# EAGLE design MicrocontrollerModule (EAGLE 8.3.2)
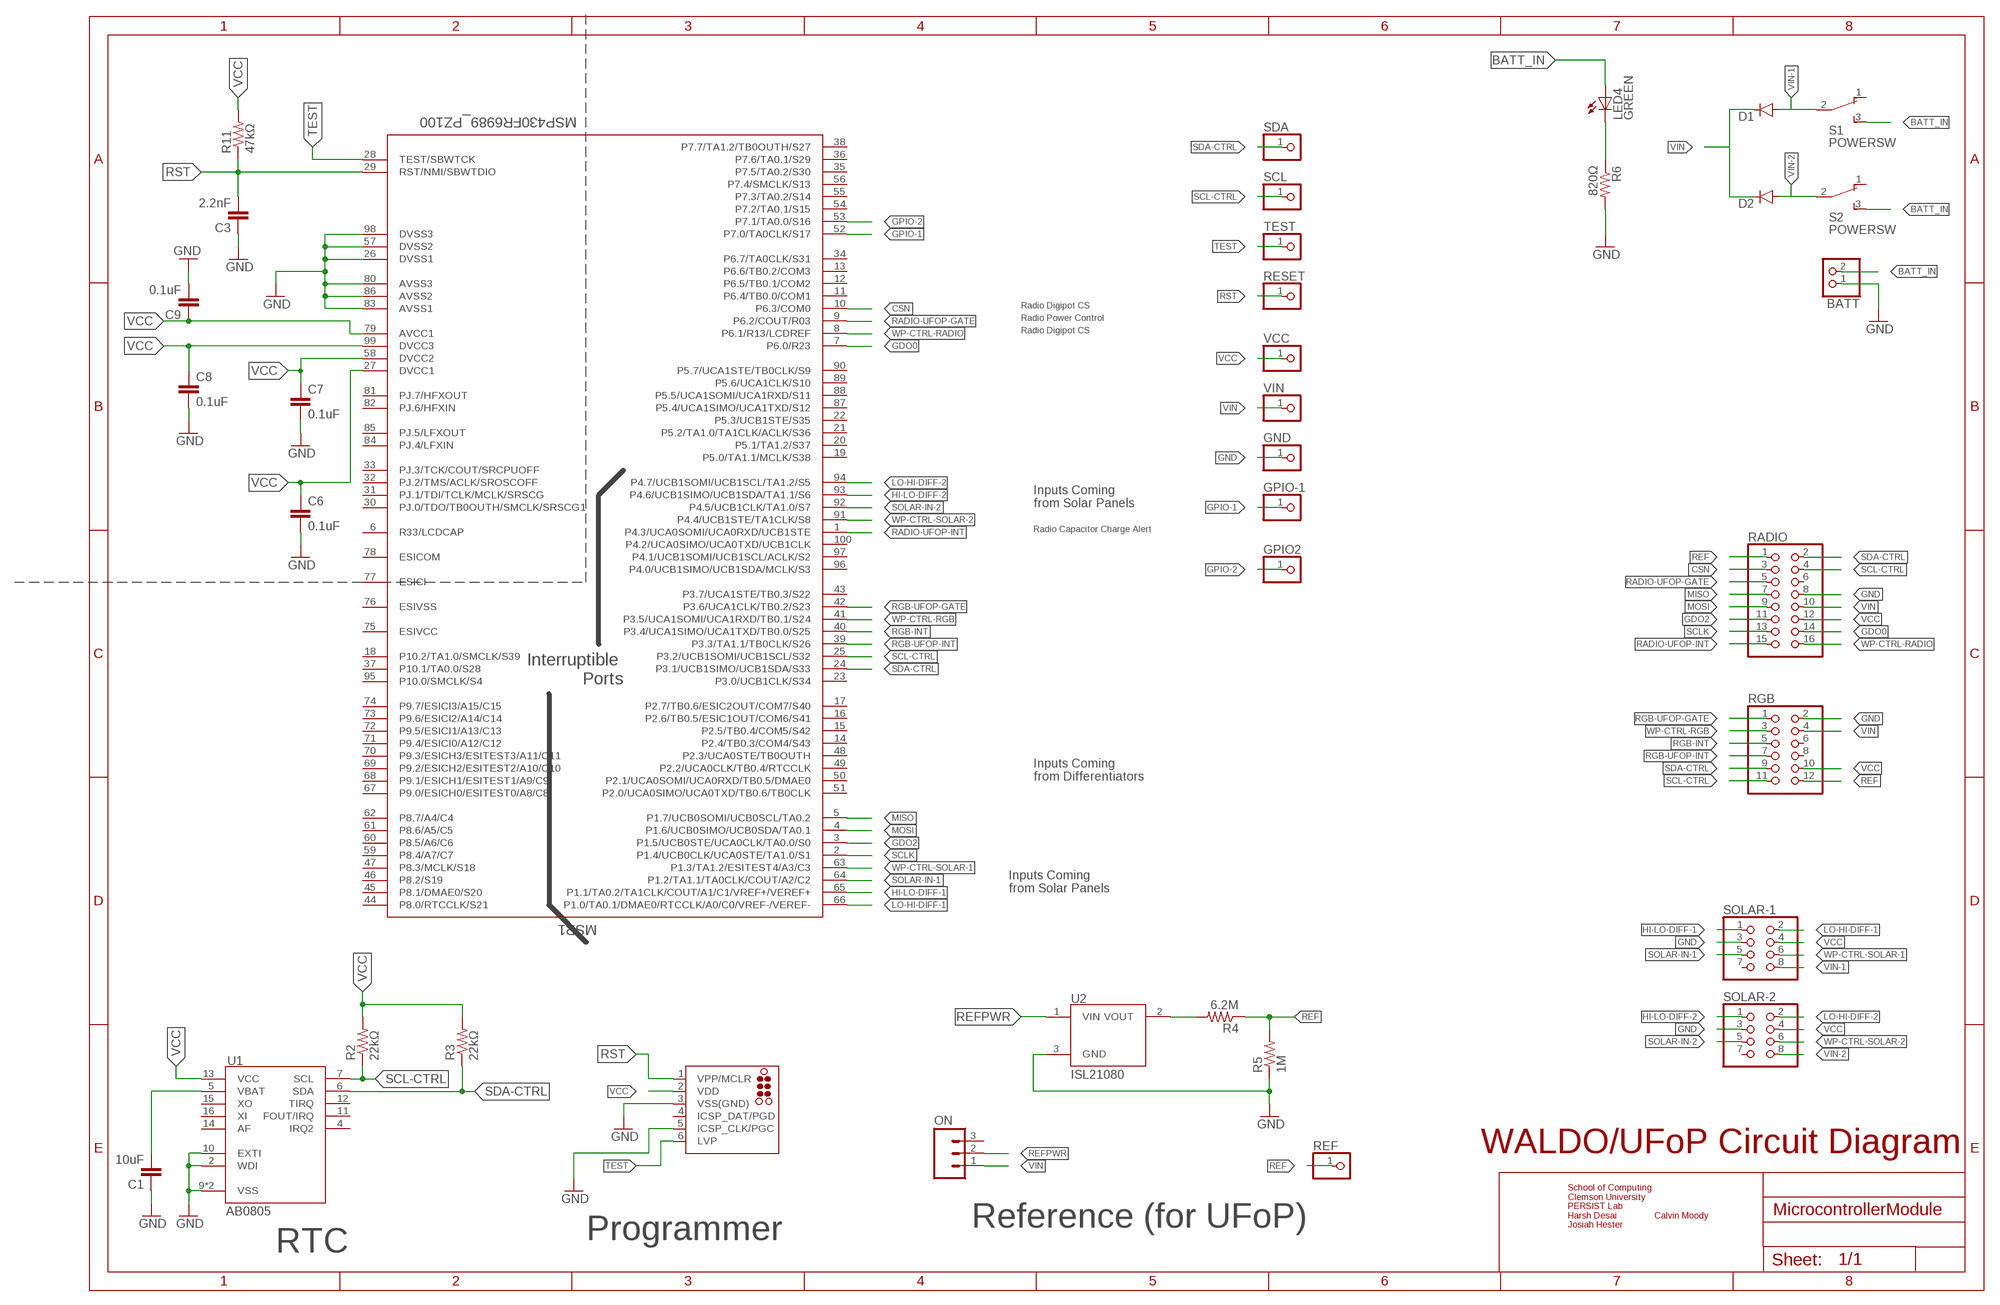
[diagram p0: schematic, sheet 1]

## Parts
BATT  PINHD-1X2  [1X02]
C1  10uF  CAP0805  [0805]
C3  2.2nF  CAP0805  [0805]
C6  0.1uF  CAP0805  [0805]
C7  0.1uF  CAP0805  [0805]
C8  0.1uF  CAP0805  [0805]
C9  0.1uF  CAP0805  [0805]
D1  DIODESOD523  [SOD523]
D2  DIODESOD523  [SOD523]
GND  PINHD-1X1  [1X01]
GPIO2  PINHD-1X1  [1X01]
GPIO-1  PINHD-1X1  [1X01]
J1  TC2030-MCP-NL  [TC2030-MCP-NL]
LED4  GREEN  LEDCHIP-LED0805  [CHIP-LED0805]
MSP1  MSP430FR6989_PZ100  [PZ100]
ON  M03  [1X03-1.27MM]
R2  22kΩ  RESISTOR0805-RES  [0805]
R3  22kΩ  RESISTOR0805-RES  [0805]
R4  6.2M  RESISTOR0805-RES  [0805]
R5  1M  RESISTOR0805-RES  [0805]
R6  820Ω  RESISTOR0805-RES  [0805]
R11  47kΩ  RESISTOR0805-RES  [0805]
RADIO  PINHD-2X8/90  [2X08/90]
REF  PINHD-1X1  [1X01]
RESET  PINHD-1X1  [1X01]
RGB  PINHD-2X6/90  [2X06/90]
S1  POWERSW  [TL3XYO]
S2  POWERSW  [TL3XYO]
SCL  PINHD-1X1  [1X01]
SDA  PINHD-1X1  [1X01]
SOLAR-1  PINHD-2X4/90  [2X04/90]
SOLAR-2  PINHD-2X4/90  [2X04/90]
TEST  PINHD-1X1  [1X01]
U1  AB0805  [QFN16]
U2  ISL21080  [SOT-23]
VCC  PINHD-1X1  [1X01]
VIN  PINHD-1X1  [1X01]

## Nets
BATT_IN: BATT.2 LED4.A S1.3(S) S2.3(S)
CSN: MSP1.10(P6.3/COM0) RADIO.3
GDO0: MSP1.7(P6.0/R23) RADIO.14
GDO2: MSP1.3(P1.5/UCB0STE/UCA0CLK/TA0.0/S0) RADIO.11
GND: BATT.1 C1.1 C3.1 C6.2 C7.2 C8.2 C9.2 GND.1 J1.3(VSS(GND)) J1.5(ICSP_CLK/PGC) MSP1.26(DVSS1) MSP1.57(DVSS2) MSP1.80(AVSS3) MSP1.83(AVSS1) MSP1.86(AVSS2) MSP1.98(DVSS3) R5.1 R6.2 RADIO.8 RGB.2 SOLAR-1.3 SOLAR-2.3 U1.2(WDI) U1.9(VSS) U1.10(EXTI) U1.TH(VSS) U2.3(GND)
GPIO-1: GPIO-1.1 MSP1.52(P7.0/TA0CLK/S17)
GPIO-2: GPIO2.1 MSP1.53(P7.1/TA0.0/S16)
HI-LO-DIFF-1: MSP1.65(P1.1/TA0.2/TA1CLK/COUT/A1/C1/VREF+/VEREF+) SOLAR-1.1
HI-LO-DIFF-2: MSP1.93(P4.6/UCB1SIMO/UCB1SDA/TA1.1/S6) SOLAR-2.1
LO-HI-DIFF-1: MSP1.66(P1.0/TA0.1/DMAE0/RTCCLK/A0/C0/VREF-/VEREF-) SOLAR-1.2
LO-HI-DIFF-2: MSP1.94(P4.7/UCB1SOMI/UCB1SCL/TA1.2/S5) SOLAR-2.2
MISO: MSP1.5(P1.7/UCB0SOMI/UCB0SCL/TA0.2) RADIO.7
MOSI: MSP1.4(P1.6/UCB0SIMO/UCB0SDA/TA0.1) RADIO.9
N$4: C1.2 U1.5(VBAT)
N$11: LED4.C R6.1
N$12: R4.2 U2.2(VOUT)
RADIO-UFOP-GATE: MSP1.9(P6.2/COUT/R03) RADIO.5
RADIO-UFOP-INT: MSP1.1(P4.3/UCA0SOMI/UCA0RXD/UCB1STE) RADIO.15
REF: R4.1 R5.2 RADIO.1 REF.1 RGB.12
REFPWR: ON.2 U2.1(VIN)
RGB-INT: MSP1.40(P3.4/UCA1SIMO/UCA1TXD/TB0.0/S25) RGB.5
RGB-UFOP-GATE: MSP1.42(P3.6/UCA1CLK/TB0.2/S23) RGB.1
RGB-UFOP-INT: MSP1.39(P3.3/TA1.1/TB0CLK/S26) RGB.7
RST: C3.2 J1.1(VPP/MCLR) MSP1.29(RST/NMI/SBWTDIO) R11.1 RESET.1
SCL-CTRL: MSP1.25(P3.2/UCB1SOMI/UCB1SCL/S32) R2.1 RADIO.4 RGB.11 SCL.1 U1.7(SCL)
SCLK: MSP1.2(P1.4/UCB0CLK/UCA0STE/TA1.0/S1) RADIO.13
SDA-CTRL: MSP1.24(P3.1/UCB1SIMO/UCB1SDA/S33) R3.1 RADIO.2 RGB.9 SDA.1 U1.6(SDA)
SOLAR-IN-1: MSP1.64(P1.2/TA1.1/TA0CLK/COUT/A2/C2) SOLAR-1.5
SOLAR-IN-2: MSP1.92(P4.5/UCB1CLK/TA1.0/S7) SOLAR-2.5
TEST: J1.6(LVP) MSP1.28(TEST/SBWTCK) TEST.1
VCC: C6.1 C7.1 C8.1 C9.1 J1.2(VDD) MSP1.27(DVCC1) MSP1.58(DVCC2) MSP1.79(AVCC1) MSP1.99(DVCC3) R2.2 R3.2 R11.2 RADIO.12 RGB.10 SOLAR-1.4 SOLAR-2.4 U1.13(VCC) VCC.1
VIN: D1.C D2.C ON.1 RADIO.10 RGB.4 VIN.1
VIN-1: D1.A S1.2(P) SOLAR-1.8
VIN-2: D2.A S2.2(P) SOLAR-2.8
WP-CTRL-RADIO: MSP1.8(P6.1/R13/LCDREF) RADIO.16
WP-CTRL-RGB: MSP1.41(P3.5/UCA1SOMI/UCA1RXD/TB0.1/S24) RGB.3
WP-CTRL-SOLAR-1: MSP1.63(P1.3/TA1.2/ESITEST4/A3/C3) SOLAR-1.6
WP-CTRL-SOLAR-2: MSP1.91(P4.4/UCB1STE/TA1CLK/S8) SOLAR-2.6
Unconnected: J1.4(ICSP_DAT/PGD) MSP1.6(R33/LCDCAP) MSP1.11(P6.4/TB0.0/COM1) MSP1.12(P6.5/TB0.1/COM2) MSP1.13(P6.6/TB0.2/COM3) MSP1.14(P2.4/TB0.3/COM4/S43) MSP1.15(P2.5/TB0.4/COM5/S42) MSP1.16(P2.6/TB0.5/ESIC1OUT/COM6/S41) MSP1.17(P2.7/TB0.6/ESIC2OUT/COM7/S40) MSP1.18(P10.2/TA1.0/SMCLK/S39) MSP1.19(P5.0/TA1.1/MCLK/S38) MSP1.20(P5.1/TA1.2/S37) MSP1.21(P5.2/TA1.0/TA1CLK/ACLK/S36) MSP1.22(P5.3/UCB1STE/S35) MSP1.23(P3.0/UCB1CLK/S34) MSP1.30(PJ.0/TDO/TB0OUTH/SMCLK/SRSCG1) MSP1.31(PJ.1/TDI/TCLK/MCLK/SRSCG) MSP1.32(PJ.2/TMS/ACLK/SROSCOFF) MSP1.33(PJ.3/TCK/COUT/SRCPUOFF) MSP1.34(P6.7/TA0CLK/S31) MSP1.35(P7.5/TA0.2/S30) MSP1.36(P7.6/TA0.1/S29) MSP1.37(P10.1/TA0.0/S28) MSP1.38(P7.7/TA1.2/TB0OUTH/S27) MSP1.43(P3.7/UCA1STE/TB0.3/S22) MSP1.44(P8.0/RTCCLK/S21) MSP1.45(P8.1/DMAE0/S20) MSP1.46(P8.2/S19) MSP1.47(P8.3/MCLK/S18) MSP1.48(P2.3/UCA0STE/TB0OUTH) MSP1.49(P2.2/UCA0CLK/TB0.4/RTCCLK) MSP1.50(P2.1/UCA0SOMI/UCA0RXD/TB0.5/DMAE0) MSP1.51(P2.0/UCA0SIMO/UCA0TXD/TB0.6/TB0CLK) MSP1.54(P7.2/TA0.1/S15) MSP1.55(P7.3/TA0.2/S14) MSP1.56(P7.4/SMCLK/S13) MSP1.59(P8.4/A7/C7) MSP1.60(P8.5/A6/C6) MSP1.61(P8.6/A5/C5) MSP1.62(P8.7/A4/C4) MSP1.67(P9.0/ESICH0/ESITEST0/A8/C8) MSP1.68(P9.1/ESICH1/ESITEST1/A9/C9) MSP1.69(P9.2/ESICH2/ESITEST2/A10/C10) MSP1.70(P9.3/ESICH3/ESITEST3/A11/C11) MSP1.71(P9.4/ESICI0/A12/C12) MSP1.72(P9.5/ESICI1/A13/C13) MSP1.73(P9.6/ESICI2/A14/C14) MSP1.74(P9.7/ESICI3/A15/C15) MSP1.75(ESIVCC) MSP1.76(ESIVSS) MSP1.77(ESICI) MSP1.78(ESICOM) MSP1.81(PJ.7/HFXOUT) MSP1.82(PJ.6/HFXIN) MSP1.84(PJ.4/LFXIN) MSP1.85(PJ.5/LFXOUT) MSP1.87(P5.4/UCA1SIMO/UCA1TXD/S12) MSP1.88(P5.5/UCA1SOMI/UCA1RXD/S11) MSP1.89(P5.6/UCA1CLK/S10) MSP1.90(P5.7/UCA1STE/TB0CLK/S9) MSP1.95(P10.0/SMCLK/S4) MSP1.96(P4.0/UCB1SIMO/UCB1SDA/MCLK/S3) MSP1.97(P4.1/UCB1SOMI/UCB1SCL/ACLK/S2) MSP1.100(P4.2/UCA0SIMO/UCA0TXD/UCB1CLK) ON.3 RADIO.6 RGB.6 RGB.8 S1.1(O) S2.1(O) SOLAR-1.7 SOLAR-2.7 U1.4(IRQ2) U1.11(FOUT/IRQ) U1.12(TIRQ) U1.14(AF) U1.15(XO) U1.16(XI)

## Notes on the sheet
- Radio Digipot CS
- Radio Power Control
- Radio Digipot CS
- Inputs Coming 
  from Solar Panels
- Radio Capacitor Charge Alert
- Interruptible 
  Ports
- Inputs Coming 
  from Differentiators
- Inputs Coming 
  from Solar Panels
- WALDO/UFoP Circuit Diagram
- Reference (for UFoP)
- School of Computing
  Clemson University
  PERSIST Lab
  Harsh Desai               Calvin Moody
  Josiah Hester
- Programmer
- RTC

## Library data of the parts
BATT = pinhead:PINHD-1X2: PIN HEADER
C1 C3 C6-C9 = SparkFun-Capacitors:CAP: Capacitor Standard 0603 ceramic capacitor, and 0.1" leaded capacitor.
D1 D2 = SparkFun-DiscreteSemi:DIODE: Diode These are standard reverse protection diodes and small signal diodes. SMA package can handle up to about 1A. SOD-323 can handle about 200mA. What the SOD-323 package when ordering, there are some mfgs out there that are 5-pin packages.
GND GPIO2 GPIO-1 REF RESET SCL SDA TEST VCC VIN = adafruit:PINHD-1X1: Pin header 1x1 for 0.1" spacing With round pins
J1 = tag-connect_msp430:TC2030: TAG-CONNECT ICSP Connector Manufacturer: Tag-Connect <http://www.tag-connect.com> Cable for easy In-Circuit Serial Programming. Designed for Microchip ICD2, suitable for many others. Two variants - one "with legs" (for hands-free fit on PCB) and another "without legs" for quick programming. PAD Description 1 MCLR/Vpp 2 Vdd 3 GND 4 PGD (ISPDAT) 5 PGC (ISPCLK) 6 nc (used for LVP) ©2009 ROFA.cz - modified and updated by Robert Darlington ‹rdarlington@gmail.com›
LED4 = led:LED: LED OSRAM: - CHIPLED LG R971, LG N971, LY N971, LG Q971, LY Q971, LO R971, LY R971 LH N974, LH R974 LS Q976, LO Q976, LY Q976 LO Q996 - Hyper CHIPLED LW Q18S LB Q993, LB Q99A, LB R99A - SideLED LS A670, LO A670, LY A670, LG A670, LP A670 LB A673, LV A673, LT A673, LW A673 LH A674 LY A675 LS A676, LA A676, LO A676, LY A676, LW A676 LS A679, LY A679, LG A679 - Hyper Micro SIDELED® LS Y876, LA Y876, LO Y876, LY Y876 LT Y87S - SmartLED LW L88C, LW L88S LB L89C, LB L89S, LG L890 LS L89K, LO L89K, LY L89K LS L896, LA L896, LO L896, LY L896 - TOPLED LS T670, LO T670, LY T670, LG T670, LP T670 LSG T670, LSP T670, LSY T670, LOP T670, LYG T670 LG T671, LOG T671, LSG T671 LB T673, LV T673, LT T673, LW T673 LH T674 LS T676, LA T676, LO T676, LY T676, LB T676, LH T676, LSB T676, LW T676 LB T67C, LV T67C, LT T67C, LS T67K, LO T67K, LY T67K, LW E67C LS E67B, LA E67B, LO E67B, LY E67B, LB E67C, LV E67C, LT E67C LW T67C LS T679, LY T679, LG T679 LS T770, LO T770, LY T770, LG T770, LP T770 LB T773, LV T773, LT T773, LW T773 LH T774 LS E675, LA E675, LY E675, LS T675 LS T776, LA T776, LO T776, LY T776, LB T776 LHGB T686 LT T68C, LB T68C - Hyper Mini TOPLED® LB M676 - Mini TOPLED Santana® LG M470 LS M47K, LO M47K, LY M47K Source: http://www.osram.convergy.de LUXEON: - LUMILED® LXK2-PW12-R00, LXK2-PW12-S00, LXK2-PW14-U00, LXK2-PW14-V00 LXK2-PM12-R00, LXK2-PM12-S00, LXK2-PM14-U00 LXK2-PE12-Q00, LXK2-PE12-R00, LXK2-PE12-S00, LXK2-PE14-T00, LXK2-PE14-U00 LXK2-PB12-K00, LXK2-PB12-L00, LXK2-PB12-M00, LXK2-PB14-N00, LXK2-PB14-P00, LXK2-PB14-Q00 LXK2-PR12-L00, LXK2-PR12-M00, LXK2-PR14-Q00, LXK2-PR14-R00 LXK2-PD12-Q00, LXK2-PD12-R00, LXK2-PD12-S00 LXK2-PH12-R00, LXK2-PH12-S00 LXK2-PL12-P00, LXK2-PL12-Q00, LXK2-PL12-R00 Source: www.luxeon.com KINGBRIGHT: KA-3528ASYC Source: www.kingbright.com
MSP1 = msp430:MSP430FR6989_PZ100
ON = SparkFun-Connectors:M03: Header 3 Standard 3-pin 0.1" header. Use with straight break away headers (SKU : PRT-00116), right angle break away headers (PRT-00553), swiss pins (PRT-00743), machine pins (PRT-00117), and female headers (PRT-00115). Molex polarized connector foot print use with SKU : PRT-08232 with associated crimp pins and housings.
R2 R3 R6 R11 = SparkFun-Resistors:RESISTOR: Resistor Basic schematic elements and footprints for 0603, 1206, and PTH resistors.
R4 = SparkFun-Resistors:RESISTOR: Resistor Basic schematic elements and footprints for 0603, 1206, and PTH resistors.; DIGIKEY: 541-6.20MHCT-ND
R5 = SparkFun-Resistors:RESISTOR: Resistor Basic schematic elements and footprints for 0603, 1206, and PTH resistors.; DIGIKEY: 311-1.00MHRCT-ND
RADIO = pinhead:PINHD-2X8: PIN HEADER
RGB = pinhead:PINHD-2X6: PIN HEADER
S1 S2 = GreenBoard:POWERSW: TINY SWITCH ON - ON Source: http://www2.produktinfo.conrad.com/datenblaetter/700000-724999/705152-da-01-de-Subminiaturschalter_TL_36YO.pdf
SOLAR-1 SOLAR-2 = pinhead:PINHD-2X4: PIN HEADER
U1 = AB08XX:AB0805: AB08X5 Real-Time Clock Family: I2C Version The ABRACON AB08X5 Real-Time Clock family provides a groundbreaking combination of ultra-low power coupled with a highly sophisticated feature set. With power requirements significantly lower than any other industry RTC (as low as 14 nA), these are the first semiconductors based on innovative SPOTTM (Subthreshold Power Optimized Technology) CMOS platform. The AB08X5 includes on-chip oscillators to provide minimum power consumption, full RTC functions including battery backup and programmable counters and alarms for timer and watchdog functions, and either an I2C or SPI serial interface for communication with a host controller.; MOUSER: 815-AB0805-T3
U2 = isl21080:ISL21080: Intersil: ISL21080, 300nA NanoPower Voltage References The ISL21080 analog voltage references feature low supply voltage operation at ultra-low 310nA typ, 1.5µA max operating current. Additionally, the ISL21080 family features guaranteed initial accuracy as low as ±0.2% and 50ppm/°C temperature coefficient. These references are ideal for general purpose portable applications to extend battery life at lower cost. The ISL21080 is provided in the industry standard 3 Ld SOT-23 pinout. The ISL21080 output voltages can be used as precision voltage sources for voltage monitors, control loops, standby voltages for low power states for DSP, FPGA, Datapath Controllers, microcontrollers and other core voltages: 0.9V, 1.024V, 1.25V, 1.5V, 2.048V, 2.5V, 3.0V, 3.3V, 4.096V and 5.0V. Special Note: Post-assembly x-ray inspection may lead to permanent changes in device output voltage and should be minimized or avoided. For further information, please see “Applications Information” on page 14 and AN1533, “X-Ray Effects on Intersil FGA References”.; DIGIKEY: ISL21080DIH309Z-TKCT-ND

## Board
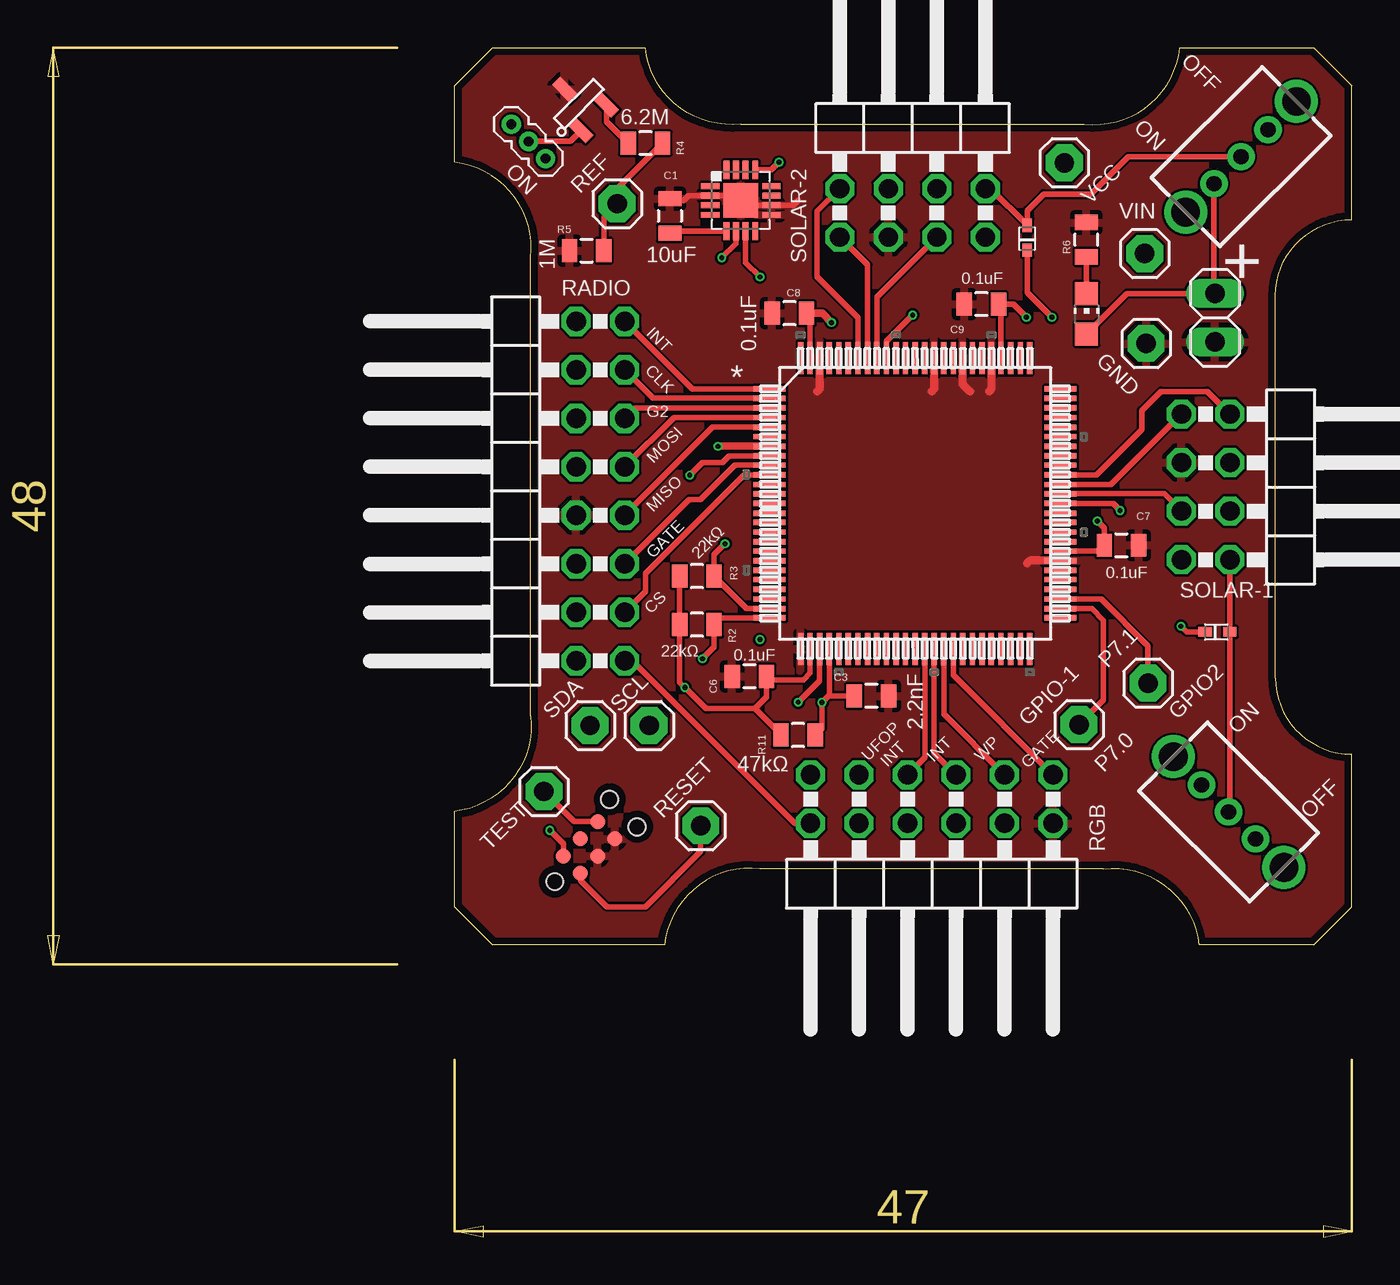
[diagram p1: board, top side]
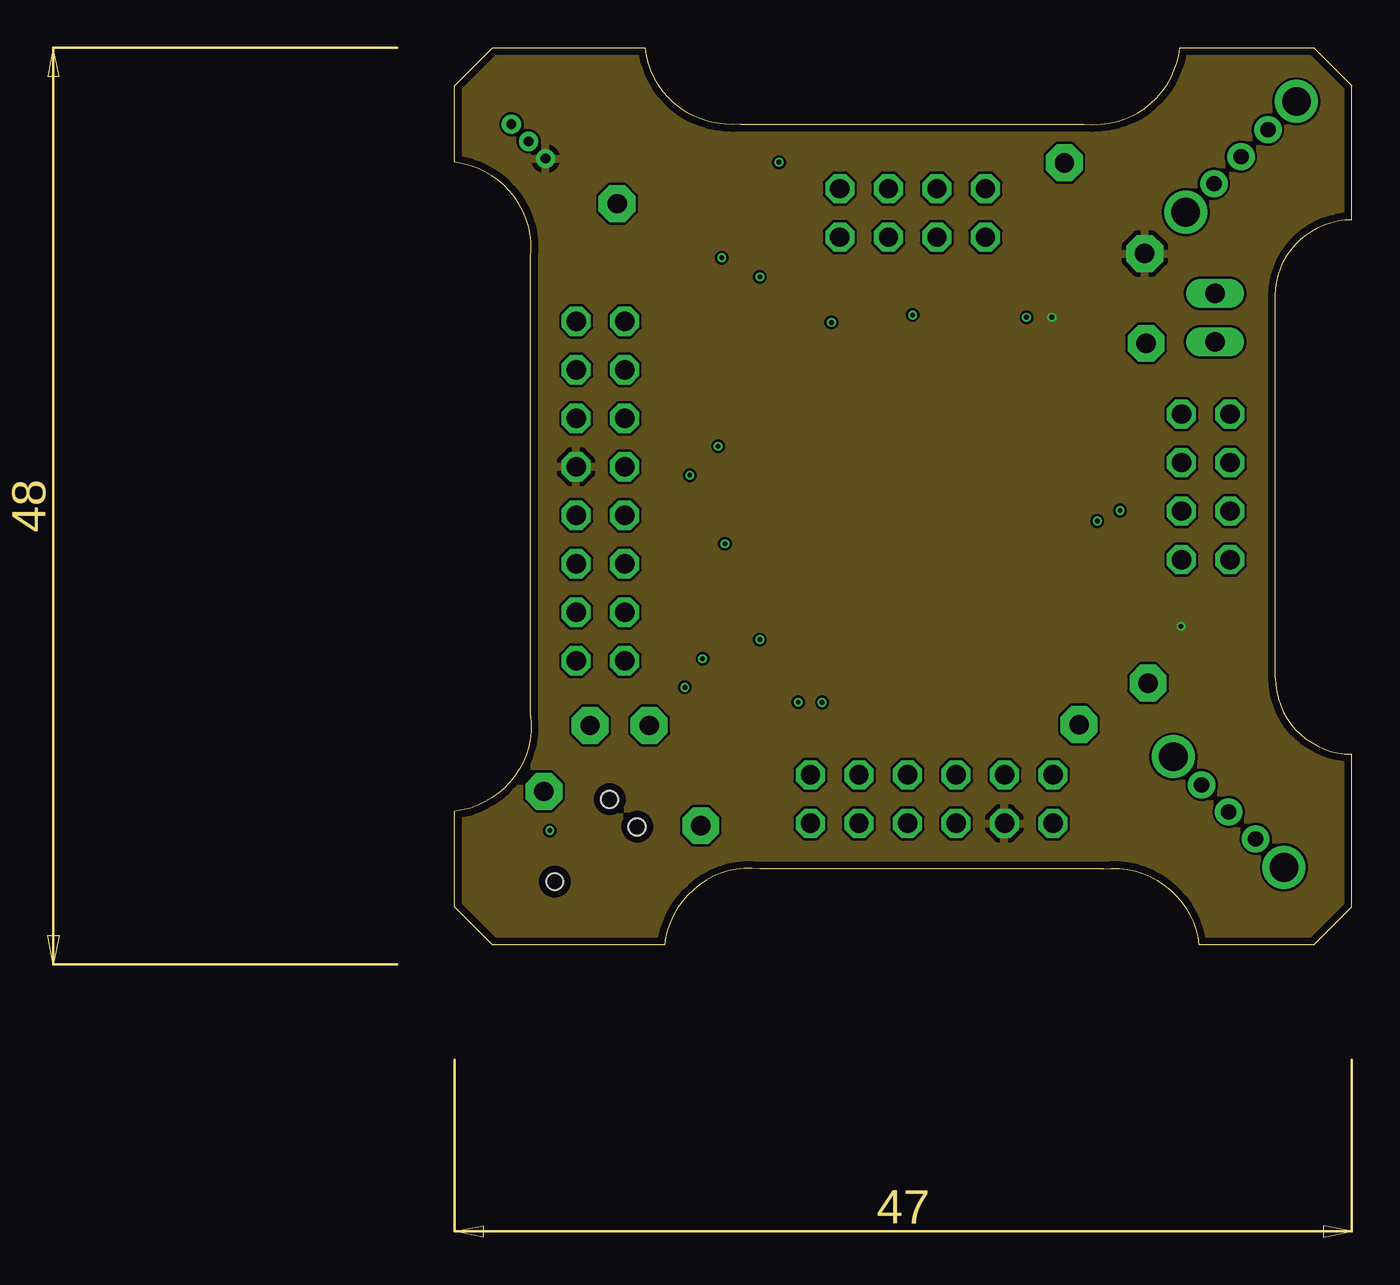
[diagram p2: board, inner layer Vin]
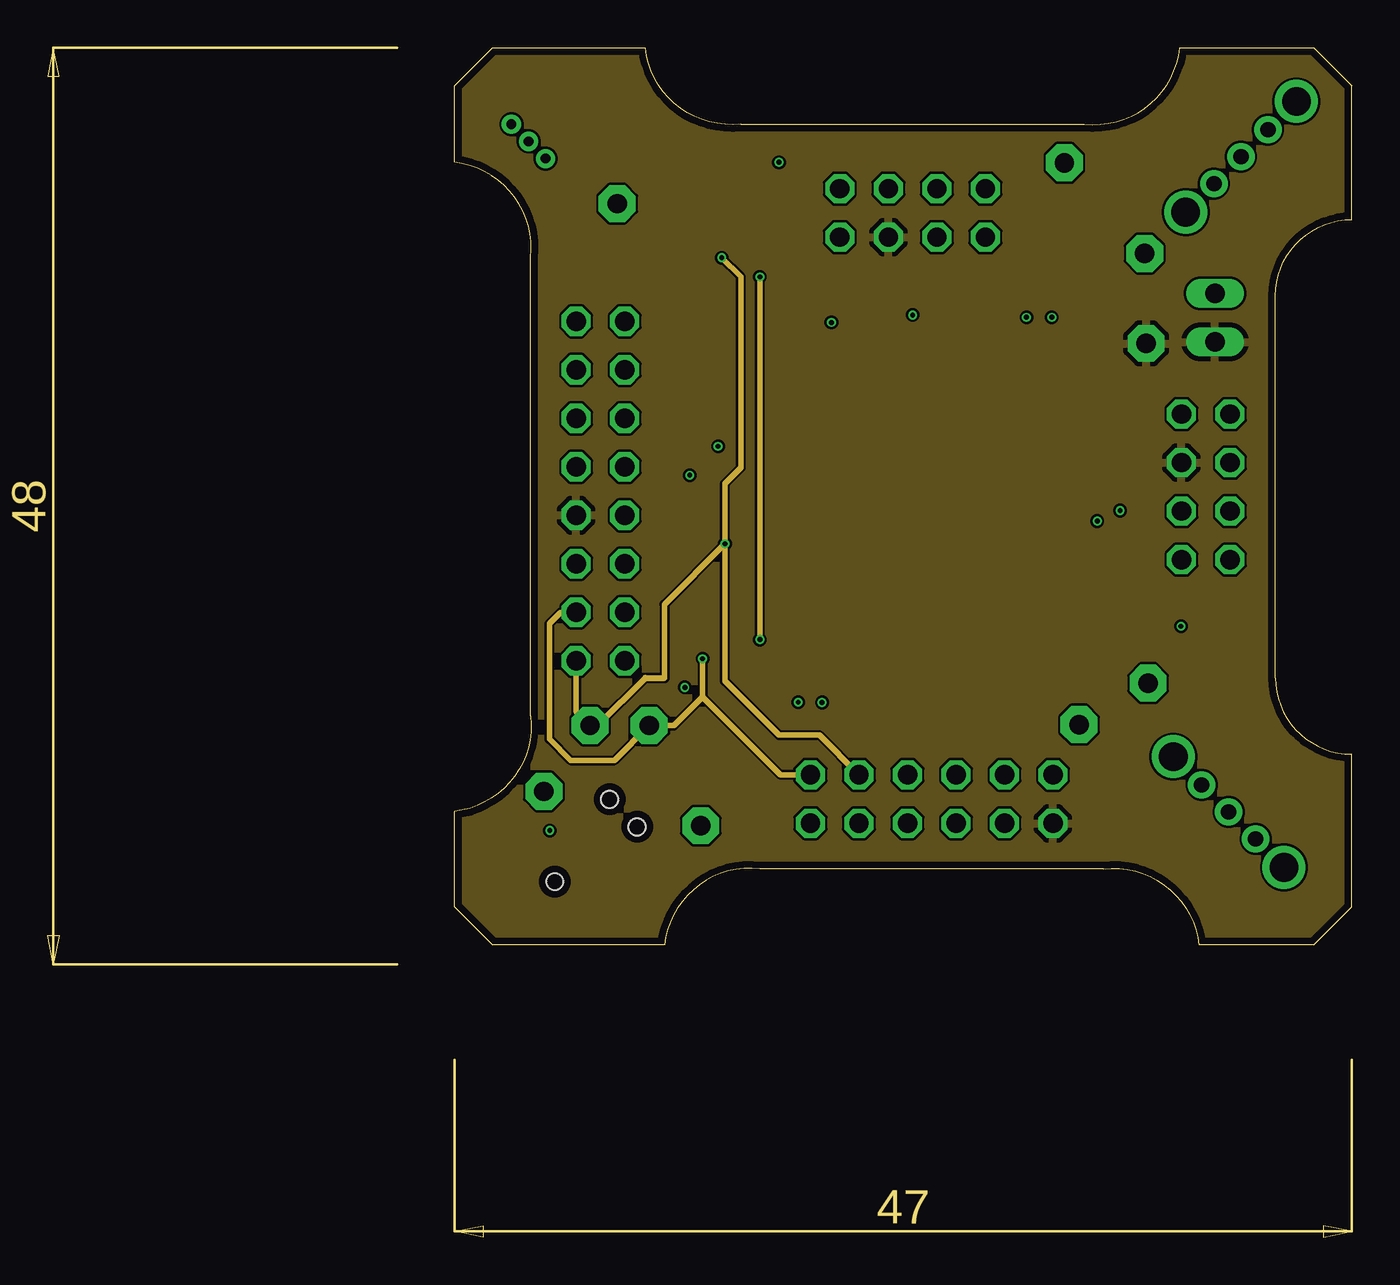
[diagram p3: board, inner layer Ground]
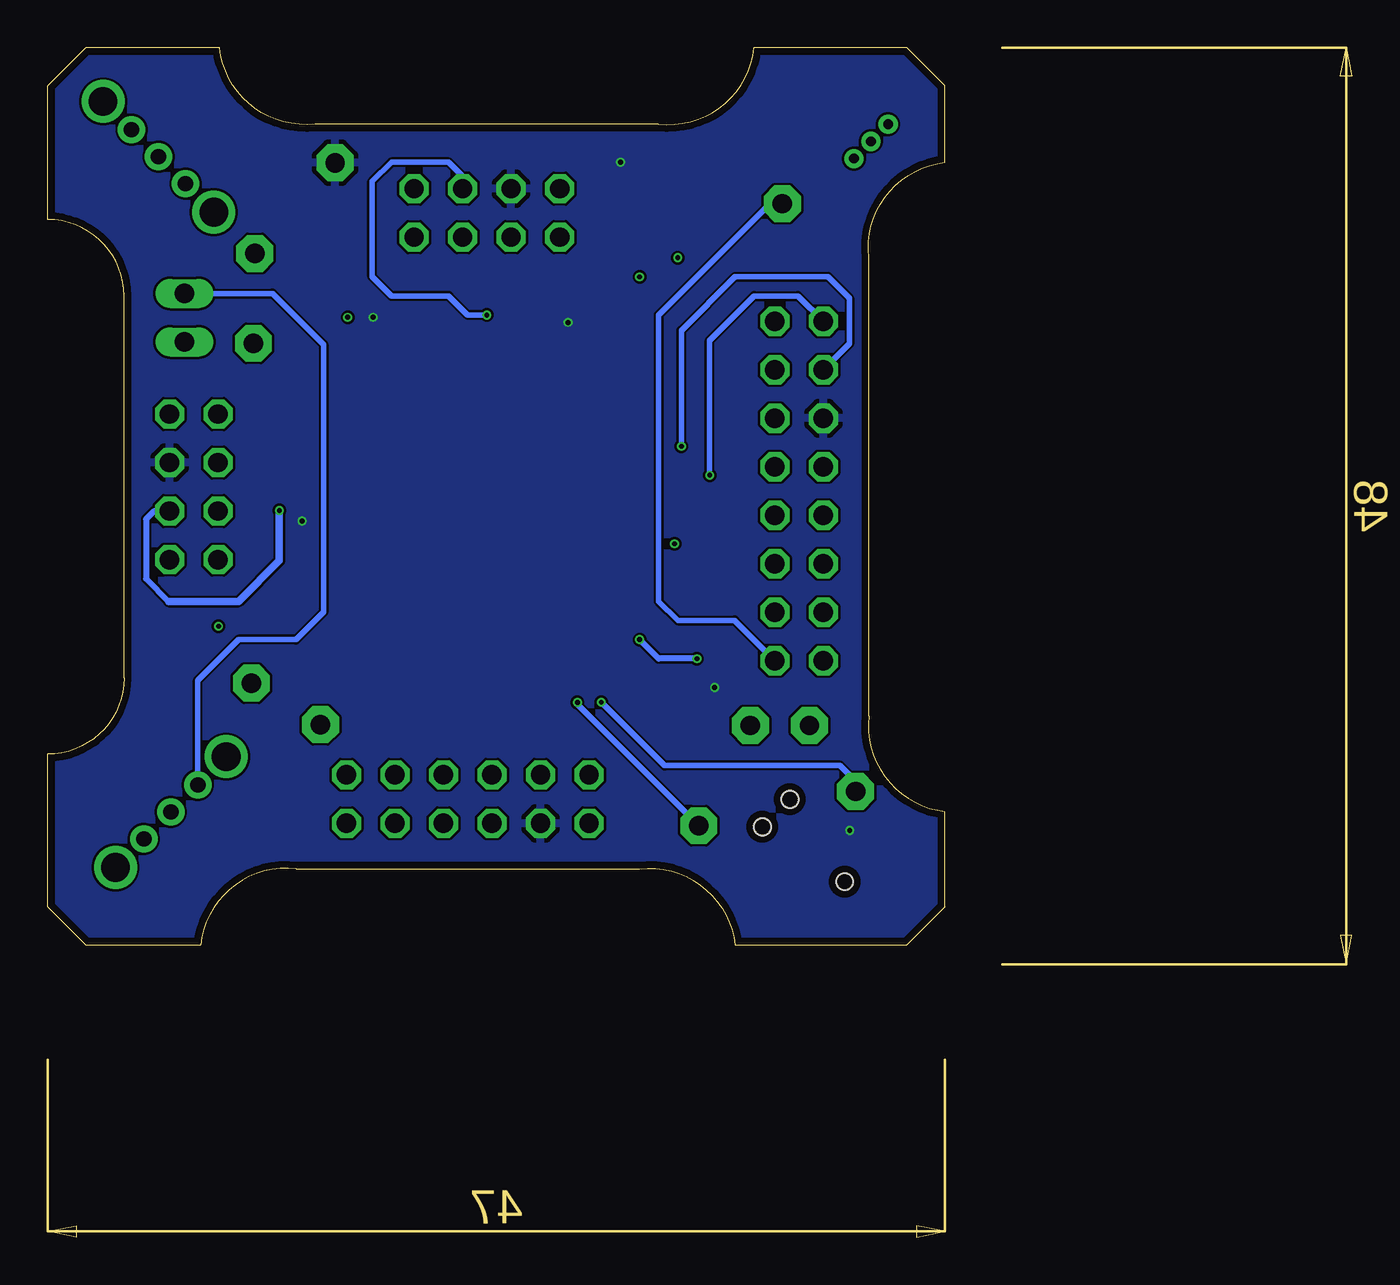
[diagram p4: board, bottom side, seen from below]

Size 47 x 47 mm. Coordinates in mm from the lower left corner, seen from the top.
Outline: 15,43 33,43 arc90 38,47 45,47 47,45 47,38 arc90 43,34 43,14 arc90 47,10 47,2 45,0 39,0 arc90 34,4 16,4 arc90 11,0 2,0 0,2 0,7 arc90 4,12 4,36 arc90 0,41 0,45 2,47 10,47 arc90 15,43
Copper layers (1*2*15*16): Top 0.035559375mm / dielectric 0.17018125mm / Vin 0.01778125mm / dielectric 47mil / Ground 0.01778125mm / dielectric 0.17018125mm / Bottom 0.035559375mm
Design rules "OSHPark-4layer": minimum track width 5mil, minimum drill 10mil, track to track 5mil, track to pad 5mil, pad to pad 5mil, via to via 5mil, smd to smd 5mil, copper to edge 15mil, drill to drill 6mil, minimum pad ring 4mil, minimum via ring 4mil, stop-mask expansion 2.5mil, vias tented up to drill 0mil, thermal gap 10mil

### Footprints (pad centres in the part's own frame; a part is rotated, then mirrored left to right if it is on the bottom)
1X02 = drill 1.016 long: 1 -1.27,0; 2 1.27,0
0805 = smd 0.8 x 1.2: 1 -0.9,0; 2 0.9,0
SOD523 = smd 0.7 x 0.5: A 0.7,0; C -0.6,0
1X01 = drill 1.016 pad 1.93 octagon: 1 0,0
TC2030-MCP-NL = smd 0.787 x 0.787: 1 1.27,-0.635; 2 1.27,0.635; 3 2.54,-0.635; 4 2.54,0.635; 5 3.81,-0.635; 6 3.81,0.635 | hole 0.889: 0,0; 5.08,-1.016; 5.08,1.016
CHIP-LED0805 = smd 1.2 x 1.2: A 0,-1.05; C 0,1.05
PZ100 = smd 1.676 x 0.279: 1 -7.62,5.994; 2 -7.62,5.512; 3 -7.62,5.004; 4 -7.62,4.496; 5 -7.62,3.988; 6 -7.62,3.505; 7 -7.62,2.997; 8 -7.62,2.489; 9 -7.62,2.007; 10 -7.62,1.499; 11 -7.62,0.991; 12 -7.62,0.508; 13 -7.62,0; 14 -7.62,-0.508; 15 -7.62,-0.991; 16 -7.62,-1.499; 17 -7.62,-2.007; 18 -7.62,-2.489; 19 -7.62,-2.997; 20 -7.62,-3.505; 21 -7.62,-3.988; 22 -7.62,-4.496; 23 -7.62,-5.004; 24 -7.62,-5.512; 25 -7.62,-5.994; 51 7.62,-5.994; 52 7.62,-5.512; 53 7.62,-5.004; 54 7.62,-4.496; 55 7.62,-3.988; 56 7.62,-3.505; 57 7.62,-2.997; 58 7.62,-2.489; 59 7.62,-2.007; 60 7.62,-1.499; 61 7.62,-0.991; 62 7.62,-0.508; 63 7.62,0; 64 7.62,0.508; 65 7.62,0.991; 66 7.62,1.499; 67 7.62,2.007; 68 7.62,2.489; 69 7.62,2.997; 70 7.62,3.505; 71 7.62,3.988; 72 7.62,4.496; 73 7.62,5.004; 74 7.62,5.512; 75 7.62,5.994 | smd 0.279 x 1.676: 26 -5.994,-7.62; 27 -5.512,-7.62; 28 -5.004,-7.62; 29 -4.496,-7.62; 30 -3.988,-7.62; 31 -3.505,-7.62; 32 -2.997,-7.62; 33 -2.489,-7.62; 34 -2.007,-7.62; 35 -1.499,-7.62; 36 -0.991,-7.62; 37 -0.508,-7.62; 38 0,-7.62; 39 0.508,-7.62; 40 0.991,-7.62; 41 1.499,-7.62; 42 2.007,-7.62; 43 2.489,-7.62; 44 2.997,-7.62; 45 3.505,-7.62; 46 3.988,-7.62; 47 4.496,-7.62; 48 5.004,-7.62; 49 5.512,-7.62; 50 5.994,-7.62; 76 5.994,7.62; 77 5.512,7.62; 78 5.004,7.62; 79 4.496,7.62; 80 3.988,7.62; 81 3.505,7.62; 82 2.997,7.62; 83 2.489,7.62; 84 2.007,7.62; 85 1.499,7.62; 86 0.991,7.62; 87 0.508,7.62; 88 0,7.62; 89 -0.508,7.62; 90 -0.991,7.62; 91 -1.499,7.62; 92 -2.007,7.62; 93 -2.489,7.62; 94 -2.997,7.62; 95 -3.505,7.62; 96 -3.988,7.62; 97 -4.496,7.62; 98 -5.004,7.62; 99 -5.512,7.62; 100 -5.994,7.62
1X03-1.27MM = drill 0.508 pad 1: 1 -1.27,0; 2 0,0; 3 1.27,0
2X08/90 = drill 1.016 octagon: 1 -8.89,-6.35; 2 -8.89,-3.81; 3 -6.35,-6.35; 4 -6.35,-3.81; 5 -3.81,-6.35; 6 -3.81,-3.81; 7 -1.27,-6.35; 8 -1.27,-3.81; 9 1.27,-6.35; 10 1.27,-3.81; 11 3.81,-6.35; 12 3.81,-3.81; 13 6.35,-6.35; 14 6.35,-3.81; 15 8.89,-6.35; 16 8.89,-3.81
2X06/90 = drill 1.016 octagon: 1 -6.35,-6.35; 2 -6.35,-3.81; 3 -3.81,-6.35; 4 -3.81,-3.81; 5 -1.27,-6.35; 6 -1.27,-3.81; 7 1.27,-6.35; 8 1.27,-3.81; 9 3.81,-6.35; 10 3.81,-3.81; 11 6.35,-6.35; 12 6.35,-3.81
TL3XYO = drill 0.8 pad 1.422: 1 -2,0; 2 0,0; 3 2,0 | drill 1.5 pad 1.93: M1 -4.1,0; M2 4.1,0
2X04/90 = drill 1.016 octagon: 1 -3.81,-6.35; 2 -3.81,-3.81; 3 -1.27,-6.35; 4 -1.27,-3.81; 5 1.27,-6.35; 6 1.27,-3.81; 7 3.81,-6.35; 8 3.81,-3.81
QFN16 = smd 0.95 x 0.3: 1 -1.6,0.75; 2 -1.6,0.25; 3 -1.6,-0.25; 4 -1.6,-0.75; 9 1.6,-0.75; 10 1.6,-0.25; 11 1.6,0.25; 12 1.6,0.75 | smd 0.3 x 0.95: 5 -0.75,-1.6; 6 -0.25,-1.6; 7 0.25,-1.6; 8 0.75,-1.6; 13 0.75,1.6; 14 0.25,1.6; 15 -0.25,1.6; 16 -0.75,1.6 | smd 1.8 x 1.8: TH 0,0
SOT-23 = smd 0.6 x 1.25: 1 -0.95,-1.075; 2 0.95,-1.075; 3 -0.025,1.075

### Placement (x,y rotation side)
BATT  39.84,32.86 90 top
C1  11.29,38.19 270 top
C3  21.84,13.05 180 top
C6  15.45,14.07 180 top
C7  34.94,20.94 0 top
C8  17.54,33.09 180 top
C9  27.6,33.57 180 top
D1  39.91,16.4 0 top
D2  30,37 90 top
GND  36.23,31.51 0 top
GPIO2  36.33,13.72 0 top
GPIO-1  32.72,11.55 0 top
J1  5.26,3.32 45 top
LED4  33.11,33.06 0 top
MSP1  24.13,23.13 0 top
ON  3.88,42.09 135 top
R2  12.7,16.78 180 top
R3  12.7,19.32 180 top
R4  10,42 180 top
R5  6.93,36.37 0 top
R6  33.1,36.95 90 top
R11  18,11 180 top
RADIO  2.57,23.78 90 top
REF  8.53,38.83 0 top
RESET  12.9,6.25 0 top
RGB  25,2.57 180 top
S1  40.55,6.97 135 top
S2  41.2,41.29 225 top
SCL  10.2,11.5 0 top
SDA  7.11,11.5 0 top
SOLAR-1  44.43,24 270 top
SOLAR-2  24,43.43 0 top
TEST  4.69,8.04 0 top
U1  15,39 0 top
U2  6.54,44.08 45 top
VCC  31.95,40.98 0 top
VIN  36.15,36.22 0 top

### Tracks (layer width: path | path; a pad name or v marks a point on that pad's centre or on a via)
BATT_IN
  Top 0.279: S2.3 39.79,34.18 | BATT.2 35.23,34.13 LED4.A
  Top 0.305: 39.79,34.18 BATT.2
  Bottom 0.279: BATT.2 35.23,34.13 32.56,31.46 32.56,17.44 34,16 37,16 39.14,13.86 S1.3
CSN
  Top 0.279: MSP1.10 15.17,24.63 10,19.46 10,18.51 RADIO.3
GDO0  (via drill 0.25)
  Top 0.381: MSP1.7 v13.82,26.13 v13.81,26.12
  Bottom 0.279: v13.81,26.12 13.81,32.19 11,35 6.13,35 5.01,33.88 5.01,31.5 RADIO.14
GDO2
  Top 0.279: MSP1.3 9.46,28.13 RADIO.11
GND
  Top 0.279: 14.75,39.25 U1.2 12.25,39.25 12,39 | U1.TH 15.25,38.75 U1.10 17.75,38.75
  Top 0.305: U1.TH 14.75,39.25 | 17.75,38.75 18,39
  Top 0.406: MSP1.86 25.12,29.12 25,29 | MSP1.83 26.62,29.38 27,29 | MSP1.80 28.12,29.12 28,29 | MSP1.98 19.13,29.13 19,29 | MSP1.57 30.13,20.13 30,20
  pour Top: -1.27,-2.27 -1.27,48.72 55.88,48.72 55.88,-2.27
  pour Ground: -6.35,52.53 -6.35,-6.08 59.69,-6.08 59.69,52.53
GPIO-1
  Top 0.279: MSP1.52 33.38,17.62 34,17 34,12.83 GPIO-1.1
GPIO-2
  Top 0.279: MSP1.53 33.87,18.13 36.33,15.67 GPIO2.1
HI-LO-DIFF-1
  Top 0.279: MSP1.65 34.39,24.12 SOLAR-1.1
HI-LO-DIFF-2
  Top 0.279: MSP1.93 21.64,35.63 SOLAR-2.1
LO-HI-DIFF-1
  Top 0.279: MSP1.66 33.63,24.63 36,27 36,28 37,29 39.43,29 SOLAR-1.2
LO-HI-DIFF-2
  Top 0.279: MSP1.94 21.13,32.87 19,35 19,38.43 SOLAR-2.2
MISO
  Top 0.279: MSP1.5 13.53,27.12 RADIO.7
MOSI
  Top 0.279: MSP1.4 11.5,27.63 RADIO.9
N$4
  Top 0.279: U1.5 11.4,37.4
  Top 0.305: 11.4,37.4 C1.2
N$11
  Top 0.279: R6.1 LED4.C
  Top 0.305: LED4.C
N$12
  Top 0.279: U2.2 7.97,43.13 R4.2
RADIO-UFOP-GATE
  Top 0.279: MSP1.9 14.69,25.14 12.89,23.34 12.29,23.34 RADIO.5
RADIO-UFOP-INT
  Top 0.279: RADIO.15 12.47,29.12 MSP1.1
REF
  Top 0.279: RADIO.1 9.32,14.89 17.83,6.38 RGB.12 | R4.1 8.53,39.63 REF.1 7.83,38.13 R5.2
  Top 0.305: REF.1
  Bottom 0.279: RADIO.1 11.03,17 14,17 15,18 15,33 9.17,38.83 REF.1
REFPWR
  Top 0.279: ON.2 6.07,42.09 U2.1
RGB-INT
  Top 0.279: MSP1.40 25.12,10.07 RGB.5
RGB-UFOP-GATE
  Top 0.279: MSP1.42 26.14,14.13 RGB.1
RGB-UFOP-INT
  Top 0.279: MSP1.39 24.64,9.83 RGB.7
RST  (via drill 0.25)
  Top 0.279: J1.1 6.61,3.39 8,2 10,2 12.9,4.9 RESET.1 | MSP1.29 19.63,13.09 v19.25,12.71 19.25,11.35 R11.1 | C3.2 19.67,13.05
  Top 0.305: 19.67,13.05 19.63,13.09
  Bottom 0.279: 19.25,12.61 RESET.1
  Bottom 0.305: v19.25,12.71 19.25,12.61
SCL-CTRL  (via drill 0.25)
  Top 0.279: MSP1.25 13.96,17.14 R2.1 13.6,15.6 v13,15 | U1.7 15.25,35.75 v16,35
  Ground 0.279: RADIO.4 5.57,17.43 4.98,16.84 4.98,10.79 6.09,9.68 8.38,9.68 SCL.1 11.5,11.5 13,13 | RGB.11 17.08,8.92 13,13 | v16,16 v16,35 | v13,15 13,13
  Bottom 0.305: v13,15 15,15 v16,16
SCLK
  Top 0.279: MSP1.2 10.41,28.64 RADIO.13
SDA-CTRL  (via drill 0.25)
  Top 0.279: MSP1.24 15.3,17.62 R3.1 13.6,20.45 v14.17,21.02 | U1.6 14.75,36.75 v14,36
  Ground 0.279: 11,14 11,17.85 v14.17,21.02 | RGB.9 19.11,11 17,11 14.17,13.83 v14.17,21.02 | v14.17,21.02 14.17,24.17 15,25 15,35 v14,36 | RADIO.2 6.38,12.23 SDA.1 7.5,11.5 10,14
  Ground 0.305: 10,14 11,14
SOLAR-IN-1
  Top 0.279: MSP1.64 37.17,23.64 SOLAR-1.5
SOLAR-IN-2
  Top 0.279: SOLAR-2.5 22.12,33.93 MSP1.92
TEST  (via drill 0.25)
  Top 0.279: MSP1.28 19.13,13.84 v18,12.72 | J1.6 6.27,6.46 TEST.1
  Bottom 0.279: TEST.1 4.69,8.58 5.51,9.4 14.69,9.4 v18,12.72
VCC  (via drill 0.25)
  Top 0.279: MSP1.79 28.63,33.44 | MSP1.99 18.62,32.91 | MSP1.58 33.74,20.64 C7.1 34.04,21.84 v33.67,22.21 | MSP1.27 18.62,14.24 18.27,13.89 16.53,13.89 C6.1 16.35,12.99 15.74,12.38 | C9.1 29.29,33.57 v29.96,32.88 | R3.2 R2.2 11.8,13.77 v12.07,13.5 13.19,12.38 13.34,12.38 15.74,12.38 | J1.2 5.71,5.29 v5,6 | U1.13 16.6,40.6 v17,41 | 17.1,11.02 15.74,12.38
  Top 0.305: R11.2 17.1,11.02
  Top 0.381: 16.42,14 C6.1 | C8.1 19.27,33.09 v19.75,32.61
  Top 0.406: 28.63,33.44 C9.1 | 18.62,32.91 C8.1
  pour Bottom: -3.81,-3.54 -3.81,49.99 49.53,49.99 57.15,38.37 57.15,-3.54
VIN  (via drill 0.25)
  Top 0.279: v31.29,32.88 30,34.17 D2.C | D1.C 38.35,16.4 v38.06,16.7
  pour Vin: -5.08,52.26 -5.08,-4.81 58.42,-4.81 58.42,52.26
VIN-1
  Top 0.279: SOLAR-1.8 D1.A | D1.A 40.61,7.03 S1.2
  Top 0.305: D1.A
VIN-2
  Top 0.279: 28.08,39.62 D2.A 30,38.47 30.87,39.34 33.34,39.34 35.29,41.29 S2.2
  Top 0.406: SOLAR-2.8 28.08,39.62
WP-CTRL-RADIO  (via drill 0.25)
  Top 0.279: MSP1.8 14.38,25.62 14.04,25.28 13,25.28 v12.33,24.61
  Bottom 0.279: v12.33,24.61 12.33,31.67 10,34 7.71,34 RADIO.16
WP-CTRL-RGB
  Top 0.279: MSP1.41 25.63,12.1 RGB.3
WP-CTRL-SOLAR-1  (via drill 0.25)
  Top 0.279: MSP1.63 34.5,23.13 v34.87,22.76
  Bottom 0.305: SOLAR-1.6 41.43,22.73 41.85,22.31 41.85,19.19 40.66,18
  Bottom 0.381: v34.87,22.76 34.87,20.13 37,18 40.66,18
WP-CTRL-SOLAR-2  (via drill 0.25)
  Top 0.279: MSP1.91 22.63,31.63 v24,33
  Bottom 0.279: v24,33 25,33 26,34 29,34 30,35 30,40 29,41 26,41 25.27,40.27 | 25.27,40.27 SOLAR-2.6 25.27,40.27

### Text on the board
tPlace: OFF | ON | + | INT | CLK | G2 | MOSI | MISO | GATE | CS | P7.1 | ON | UFOP / INT | INT | WP | GATE | P7.0 | OFF